# Altium schematic sheet stm32f103.SchDoc: Wprowadź Tytuł
size A4; CheckedBy: Wprowadź sprawdzającego; DrawnBy: Wprowadź autora; Organization: Koło Naukowe Robotyków; Address1: Nowowiejska 24; Address2: 00-001; Address3: Wraszawa; Address4: Polska; Revision: Numer; Nazwa Arkusza: Wpisz nazwę arkusza; ProjectName: Nazwa Projektu
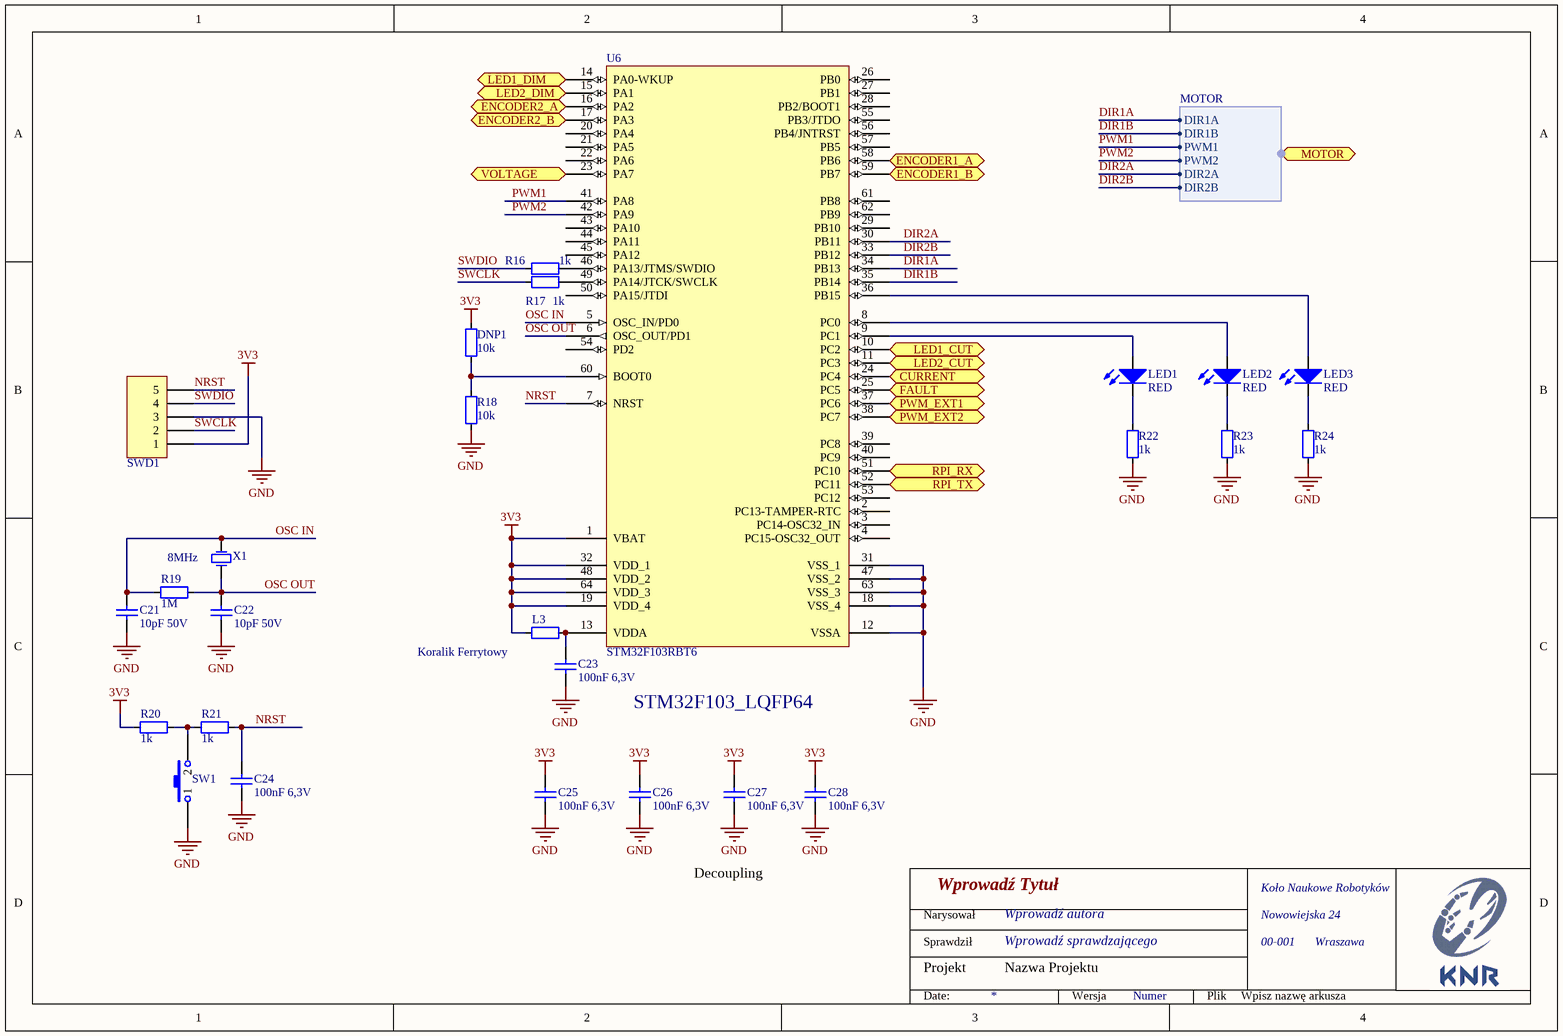
[diagram p0: stm32f103.SchDoc]

## Parts
C21  10pF 50V  [0603_CAP]
C22  10pF 50V  [0603_CAP]
C23  100nF 6,3V  [0603_CAP]
C24  100nF 6,3V  [0603_CAP]
C25  100nF 6,3V  [0603_CAP]
C26  100nF 6,3V  [0603_CAP]
C27  100nF 6,3V  [0603_CAP]
C28  100nF 6,3V  [0603_CAP]
DNP1  10k  [0603]
L3  Koralik Ferrytowy  [0603]
LED1  RED  [0603_led_green]
LED2  RED  [0603_led_red]
LED3  RED  [0603_led_blue]
R16  1k  [0603]
R17  1k  [0603]
R18  10k  [0603]
R19  1M  [0603]
R20  1k  [0603]
R21  1k  [0603]
R22  1k  [RES_0603]
R23  1k  [RES_0603]
R24  1k  [RES_0603]
SW1  Micro_Switch  [Tact 34N-F]  (value not drawn)
SWD1  HDR1X5  [Molex SPOX Horizontal 5 Circuits]  (value not drawn)
U6  STM32F103RBT6  [LQFP64_L]
X1  8MHz  [HC49-4H_THT]

## Ports
CURRENT, ENCODER1_A, ENCODER1_B, ENCODER2_A, ENCODER2_B, FAULT, LED1_CUT, LED1_DIM, LED2_CUT, LED2_DIM, MOTOR (harness MOTOR), PWM_EXT1, PWM_EXT2, RPI_RX, RPI_TX, VOLTAGE

## Harnesses
MOTOR: DIR2B, DIR2A, PWM2, PWM1, DIR1B, DIR1A

## Nets
3V3: C25.1 C26.1 C27.1 C28.1 DNP1.1 L3.1 R20.2 SWD1.1 U6.1(VBAT) U6.19(VDD_4) U6.32(VDD_1) U6.48(VDD_2) U6.64(VDD_3)
GND: C21.2 C22.2 C23.2 C24.2 C25.2 C26.2 C27.2 C28.2 R18.2 R22.1 R23.1 R24.1 SW1.1 SWD1.3 U6.12(VSSA) U6.18(VSS_4) U6.31(VSS_1) U6.47(VSS_2) U6.63(VSS_3)
CURRENT: U6.24(PC4) ; port CURRENT
DIR1A: U6.34(PB13) ; port MOTOR.DIR1A
DIR1B: U6.35(PB14) ; port MOTOR.DIR1B
DIR2A: U6.30(PB11) ; port MOTOR.DIR2A
DIR2B: U6.33(PB12) ; port MOTOR.DIR2B
ENCODER1_A: U6.58(PB6) ; port ENCODER1_A
ENCODER1_B: U6.59(PB7) ; port ENCODER1_B
ENCODER2_A: U6.16(PA2) ; port ENCODER2_A
ENCODER2_B: U6.17(PA3) ; port ENCODER2_B
FAULT: U6.25(PC5) ; port FAULT
LED1_CUT: U6.10(PC2) ; port LED1_CUT
LED1_DIM: U6.14(PA0-WKUP) ; port LED1_DIM
LED2_CUT: U6.11(PC3) ; port LED2_CUT
LED2_DIM: U6.15(PA1) ; port LED2_DIM
NRST: C24.1 R21.1 SWD1.5 U6.7(NRST)
OSC IN: C21.1 R19.2 U6.5(OSC_IN/PD0) X1.1(OSC1)
OSC OUT: C22.1 R19.1 U6.6(OSC_OUT/PD1) X1.2(OSC2)
PWM1: U6.41(PA8) ; port MOTOR.PWM1
PWM2: U6.42(PA9) ; port MOTOR.PWM2
PWM_EXT1: U6.37(PC6) ; port PWM_EXT1
PWM_EXT2: U6.38(PC7) ; port PWM_EXT2
RPI_RX: U6.51(PC10) ; port RPI_RX
RPI_TX: U6.52(PC11) ; port RPI_TX
SWCLK: R17.1 SWD1.2
SWDIO: R16.1 SWD1.4
VOLTAGE: U6.23(PA7) ; port VOLTAGE
NetC23_1: C23.1 L3.2 U6.13(VDDA)
NetDNP1_2: DNP1.2 R18.1 U6.60(BOOT0)
NetLED1_1: LED1.1(A) U6.9(PC1)
NetLED1_2: LED1.2(K) R22.2
NetLED2_1: LED2.1(A) U6.8(PC0)
NetLED2_2: LED2.2(K) R23.2
NetLED3_1: LED3.1(A) U6.36(PB15)
NetLED3_2: LED3.2(K) R24.2
NetR16_2: R16.2 U6.46(PA13/JTMS/SWDIO)
NetR17_2: R17.2 U6.49(PA14/JTCK/SWCLK)
NetR20_1: R20.1 R21.2 SW1.2

Not connected (* = marked no-connect by the designer): U6 2(PC13-TAMPER-RTC) 3(PC14-OSC32_IN) 4(PC15-OSC32_OUT) 20(PA4) 21(PA5) 22(PA6) 26(PB0) 27(PB1) 28(PB2/BOOT1) 29(PB10) 39(PC8) 40(PC9) 43(PA10) 44(PA11) 45(PA12) 50(PA15/JTDI) 53(PC12) 54(PD2) 55(PB3/JTDO) 56(PB4/JNTRST) 57(PB5) 61(PB8) 62(PB9)

## Notes on the sheet
- STM32F103_LQFP64
- Decoupling
- Narysował
- Sprawdził
- Projekt
- Date:
- Wersja
- Plik

## Library data of the parts
C21-C28 = Cap: Ceramic capacitor; Unit Price1: *; Unit Price2: *
  C21 C22: Value: 10pF 50V
  C23-C28: Value: 100nF 6,3V
DNP1 L3 R16-R21 = RES: Resistior
  DNP1 R18: Value: 10k
  L3: Value: Koralik Ferrytowy
  R16 R17 R20 R21: Value: 1k
  R19: Value: 1M
LED1-LED3 = LED: Light-emitting diode; COLOR: RED
R22-R24 = Resistor: Default resistor; Value: 1k
SW1 = Micro_Switch: Switch; Published: 24-Mar-1999; LatestRevisionDate: 17-Jul-2002; LatestRevisionNote: Re-released for DXP Platform.; PackageReference: SPST-2; Publisher: Altium Limited
SWD1 = HDR1X5: Header, 5-Pin; LatestRevisionDate: 17-Jul-2002; LatestRevisionNote: Re-released for DXP Platform.; Publisher: Altium Limited
U6 = STM32F103RBT6: STM32 ARM-based 32-bit; Published: 30-May-2008; DatasheetVersion: rev6, Mar-2008; PackageVersion: Mar-2008; PackageReference: LQFP64; Publisher: Altium Limited; PackageDescription: 64-Pin Low-Profile Quad Flat Pack, 10 x 10 mm Body, 0.5 mm Pitch (LQFP64); ComponentLink1Description: Manufacturer Link; ComponentLink1URL: www.st.com/stm32; ComponentLink2Description: Datasheet; ComponentLink2URL: http://www.st.com/stonline/products/literature/ds/13587.pdf
X1 = XTAL: Oscillator; Unit Price1: *; Unit Price2: *; Value: 8MHz